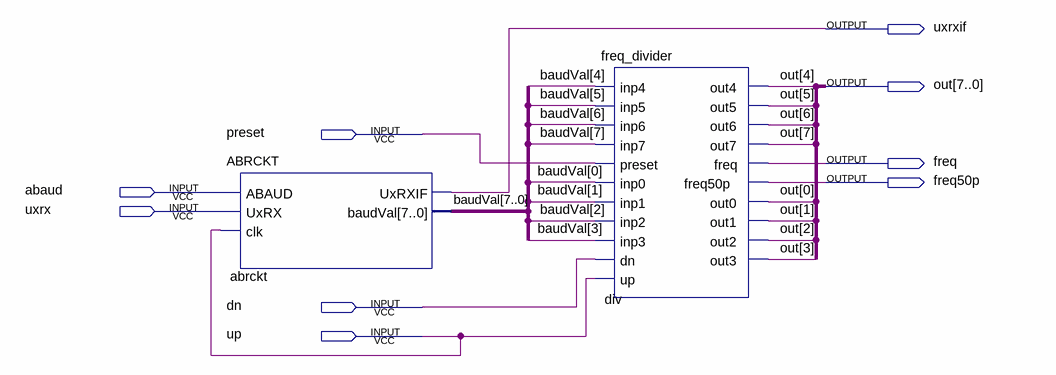
[diagram p0: schematic sheet]
// Quartus schematic BRGCKT.bdf as structural Verilog: 2 symbols, 9 pins
module BRGCKT (
  input  preset,
  input  abaud,
  input  uxrx,
  input  dn,
  input  up,
  output uxrxif,
  output [7:0] out,
  output freq,
  output freq50p
);

  wire [7:0] baudVal;

  ABRCKT abrckt (.ABAUD(abaud), .UxRX(uxrx), .clk(up), .UxRXIF(uxrxif), .baudVal(baudVal));
  freq_divider div (
    .inp4(baudVal[4]), .inp5(baudVal[5]), .inp6(baudVal[6]), .inp7(baudVal[7]), .preset(preset),
    .inp0(baudVal[0]), .inp1(baudVal[1]), .inp2(baudVal[2]), .inp3(baudVal[3]), .dn(dn), .up(up),
    .out4(out[4]), .out5(out[5]), .out6(out[6]), .out7(out[7]), .freq(freq), .freq50p(freq50p),
    .out0(out[0]), .out1(out[1]), .out2(out[2]), .out3(out[3]));
endmodule
